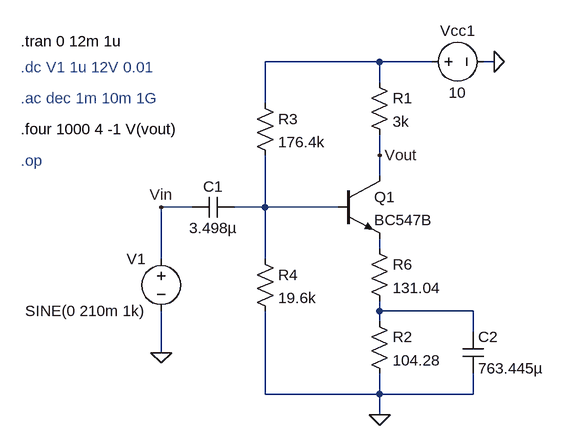
[diagram p0: schematic Theoritical Gain.asc]
Theoritical Gain.asc, the LTspice schematic file:
Version 4
SHEET 1 888 680
WIRE 624 -64 448 -64
WIRE 704 -64 624 -64
WIRE 800 -64 784 -64
WIRE 624 -32 624 -64
WIRE 448 0 448 -64
WIRE 624 80 624 48
WIRE 624 112 624 80
WIRE 336 160 288 160
WIRE 448 160 448 80
WIRE 448 160 400 160
WIRE 560 160 448 160
WIRE 624 224 624 208
WIRE 288 240 288 160
WIRE 448 240 448 160
WIRE 624 320 624 304
WIRE 768 320 624 320
WIRE 624 336 624 320
WIRE 768 352 768 320
WIRE 288 384 288 320
WIRE 448 448 448 320
WIRE 624 448 624 416
WIRE 624 448 448 448
WIRE 768 448 768 416
WIRE 768 448 624 448
WIRE 624 480 624 448
FLAG 624 480 0
FLAG 800 -64 0
FLAG 288 160 Vin
FLAG 288 384 0
FLAG 624 80 Vout
SYMBOL voltage 288 224 M0
WINDOW 123 24 124 Left 2
WINDOW 39 0 0 Left 0
SYMATTR InstName V1
SYMATTR Value SINE(0 210m 1k)
SYMBOL npn 560 112 R0
SYMATTR InstName Q1
SYMATTR Value BC547B
SYMBOL res 608 -48 R0
SYMATTR InstName R1
SYMATTR Value 3k
SYMBOL res 608 320 R0
SYMATTR InstName R2
SYMATTR Value 104.28
SYMBOL voltage 688 -64 R270
WINDOW 0 32 56 VTop 2
WINDOW 3 -32 56 VBottom 2
WINDOW 123 0 0 Left 0
WINDOW 39 0 0 Left 0
SYMATTR InstName Vcc1
SYMATTR Value 10
SYMBOL res 432 -16 R0
SYMATTR InstName R3
SYMATTR Value 176.4k
SYMBOL res 432 224 R0
SYMATTR InstName R4
SYMATTR Value 19.6k
SYMBOL cap 400 144 R90
WINDOW 0 0 32 VBottom 2
WINDOW 3 32 32 VTop 2
SYMATTR InstName C1
SYMATTR Value 3.498µ
SYMBOL res 608 208 R0
SYMATTR InstName R6
SYMATTR Value 131.04
SYMBOL cap 752 352 R0
SYMATTR InstName C2
SYMATTR Value 763.445µ
TEXT 72 -96 Left 2 !.tran 0 12m 1u
TEXT 72 -8 Left 2 ;.ac dec 1m 10m 1G
TEXT 72 -56 Left 2 ;.dc V1 1u 12V 0.01
TEXT 72 40 Left 2 !.four 1000 4 -1 V(vout)
TEXT 72 88 Left 2 ;.op

The netlist it stands for:
* Theoritical Gain.asc
V1 Vin 0 SINE(0 210m 1k)
Q1 Vout N002 N003 0 BC547B
R1 N001 Vout 3k
R2 N004 0 104.28
Vcc1 N001 0 10
R3 N001 N002 176.4k
R4 N002 0 19.6k
C1 N002 Vin 3.498µ
R6 N003 N004 131.04
C2 N004 0 763.445µ
.model NPN NPN
.model PNP PNP
.lib standard.bjt
.tran 0 12m 1u
* .ac dec 1m 10m 1G
* .dc V1 1u 12V 0.01
.four 1000 4 -1 V(vout)
* .op
.backanno
.end